# Altium schematic sheet AMC1411 ADC 센싱회로1.SchDoc: Voltage Sensing for AMC1411
size A4
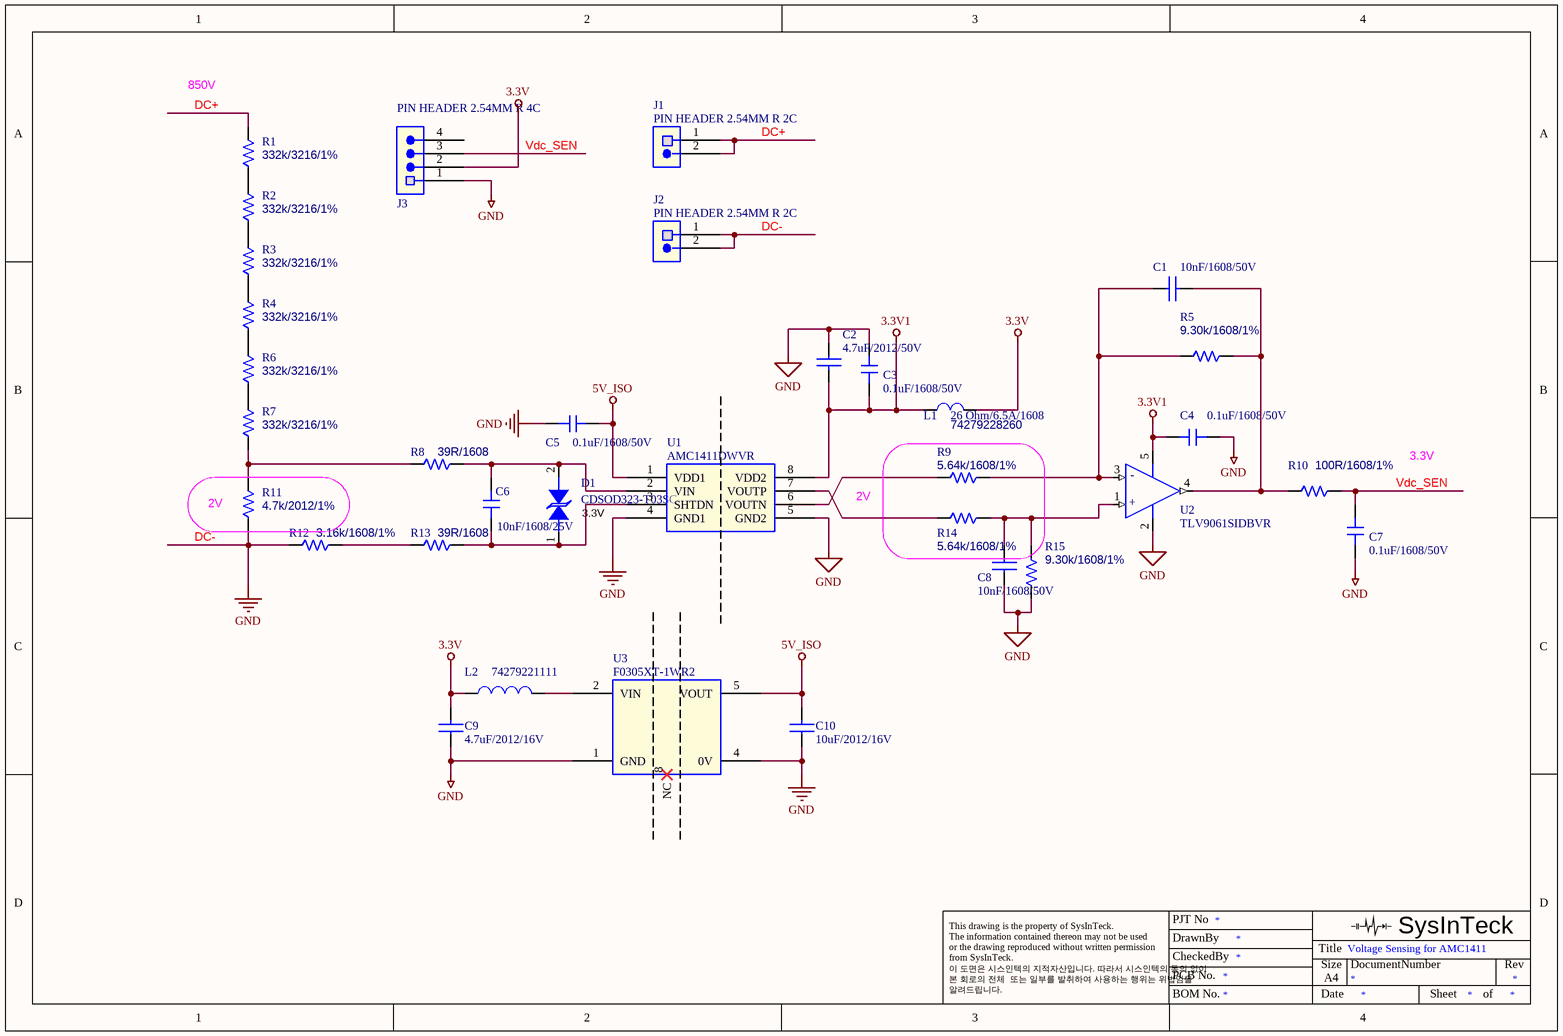
[diagram p0: AMC1411 ADC 센싱회로1.SchDoc]

## Parts
C1  10nF/1608/50V  [C-1608]
C2  4.7uF/2012/50V  [C-2012]
C3  0.1uF/1608/50V  [C-1608]
C4  0.1uF/1608/50V  [C-1608]
C5  0.1uF/1608/50V  [C-1608]
C6  10nF/1608/25V  [C-1608]
C7  0.1uF/1608/50V  [C-1608]
C8  10nF/1608/50V  [C-1608]
C9  4.7uF/2012/16V  [C-2012]
C10  10uF/2012/16V  [C-2012]
D1  CDSOD323-T03SC  [SOD-323]
J1  PIN HEADER 2.54MM R 2C  [PH2.54_1X2PA]
J2  PIN HEADER 2.54MM R 2C  [PH2.54_1X2PA]
J3  PIN HEADER 2.54MM R 4C  [PH2.54_1X4PA]
L1  26 Ohm/6.5A/1608  PN: 74279228260  [L-1608]
L2  74279221111  [L-3216]
R1  332k/3216/1%  [R-3216]
R2  332k/3216/1%  [R-3216]
R3  332k/3216/1%  [R-3216]
R4  332k/3216/1%  [R-3216]
R5  9.30k/1608/1%  [R-1608]
R6  332k/3216/1%  [R-3216]
R7  332k/3216/1%  [R-3216]
R8  39R/1608  [R-1608]
R9  5.64k/1608/1%  [R-1608]
R10  100R/1608/1%  [R-1608]
R11  4.7k/2012/1%  [R-2012]
R12  3.16k/1608/1%  [R-1608]
R13  39R/1608  [R-1608]
R14  5.64k/1608/1%  [R-1608]
R15  9.30k/1608/1%  [R-1608]
U1  AMC1411DWVR  [SO-8-300-400]
U2  TLV9061SIDBVR  [SOT-23-6]
U3  F0305XT-1WR2  [DCDC-B_XT-2WR2]

## Blocks framed on the sheet
2V: R11

## Nets
3.3V: C9.2 J3.2 L1.2 L2.1
3.3V1: C2.2 C3.2 C4.1 L1.1 U1.8(VDD2) U2.5(V+)
5V_ISO: C5.1 C10.2 U1.1(VDD1) U3.5(VOUT)
DC-: C2.1 C3.1 C4.2 C5.2 C7.2 C8.1 C9.1 C10.1 J2.1 J2.2 J3.1 R11.1 R12.2 R15.2 U1.4(GND1) U1.5(GND2) U2.2(V-) U3.1(GND) U3.4(0V)  [also labelled GND]
DC+: J1.1 J1.2 R1.2
Vdc_SEN: C7.1 J3.3 R10.1
NetC1_1: C1.1 R5.2 R9.1 U2.3(~{-IN})
NetC1_2: C1.2 R5.1 R10.2 U2.4(OUT)
NetC6_1: C6.1 D1.2 R8.1 U1.2(VIN)
NetC6_2: C6.2 D1.1 R13.1 U1.3(SHTDN)
NetC8_2: C8.2 R14.1 R15.1 U2.1(+IN)
NetL2_2: L2.2 U3.2(VIN)
NetR1_1: R1.1 R2.2
NetR2_1: R2.1 R3.2
NetR3_1: R3.1 R4.2
NetR4_1: R4.1 R6.2
NetR6_1: R6.1 R7.2
NetR7_1: R7.1 R8.2 R11.2
NetR9_2: R9.2 U1.6(VOUTN)
NetR12_1: R12.1 R13.2
NetR14_2: R14.2 U1.7(VOUTP)

Not connected (* = marked no-connect by the designer): J3 4; U3 8(NC)*

## Notes on the sheet
- 850V
- (near D1) 3.3V
- 2V
- 3.3V
- PJT No
- This drawing is the property of SysInTeck.
- The information contained thereon may not be used
- or the drawing reproduced without written permission
- from SysInTeck.
- 이 도면은 시스인텍의 지적자산입니다. 따라서 시스인텍의 동의 없이
- 본 회로의 전체  또는 일부를 발취하여 사용하는 행위는 위법임을
- 알려드립니다.
- DrawnBy
- CheckedBy
- PCB No.
- Title
- Size
- A4
- DocumentNumber
- SysInTeck
- Rev
- BOM No.
- Date
- Sheet
- of
- (in symbol TLV1391/SOT_1) -; +

## Library data of the parts
C1 C2 C8-C10 = CAPACITOR NON-POL
  C1 C8: PCB Footprint: C-1608
  C2 C9 C10: PCB Footprint: C-2012
C3-C7 = CAPACITOR NON-POL_1: PCB Footprint: C-1608
D1 = DIODE TVS BI-DIR_0: PCB Footprint: SOD-323
J1 J2 = CONN TRBLK 2_2: PCB Footprint: PH2.54_1X2PA
J3 = CONN TRBLK 4_2: PCB Footprint: PH2.54_1X4PA
L1 = INDUCTOR_2: PCB Footprint: L-1608
L2 = INDUCTOR: PCB Footprint: L-3216
R1-R8 R10 R12 R13 R15 = R: PSpiceTemplate: R^@REFDES %1 %2 ?TOLERANCE|R^@REFDES| @VALUE  ?TOLERANCE|\n.model R^@REFDES RES R=1 DEV=@TOLERANCE%|; OriginalSymbolOrigin: (0,0)
  R1-R4 R6 R7: PCB Footprint: R-3216; Value: 332k/3216/1%
  R5 R15: PCB Footprint: R-1608; Value: 9.30k/1608/1%
  R8 R13: PCB Footprint: R-1608; Value: 39R/1608
  R10: PCB Footprint: R-1608; Value: 100R/1608/1%
  R12: PCB Footprint: R-1608; Value: 3.16k/1608/1%
R9 R14 = R: PSpiceTemplate: R^@REFDES %1 %2 ?TOLERANCE|R^@REFDES| @VALUE  ?TOLERANCE|\n.model R^@REFDES RES R=1 DEV=@TOLERANCE%|; OriginalSymbolOrigin: (0,0); Value: 4.70kF/1608/1%; PCB Footprint: R-1608
R11 = R: PSpiceTemplate: R^@REFDES %1 %2 ?TOLERANCE|R^@REFDES| @VALUE  ?TOLERANCE|\n.model R^@REFDES RES R=1 DEV=@TOLERANCE%|; OriginalSymbolOrigin: (0,0); Value: 3.60k/MELF0102/1%; PCB Footprint: R-2012
U1 = AMC1311DWVR: PCB Footprint: SO-8-300-400
U2 = TLV1391/SOT_1: PCB Footprint: SOT-23-6
U3 = F0305XT-1WR2_1: PCB Footprint: DCDC-B_XT-2WR2